# EAGLE design photodiodes-board (EAGLE 7.6.0)
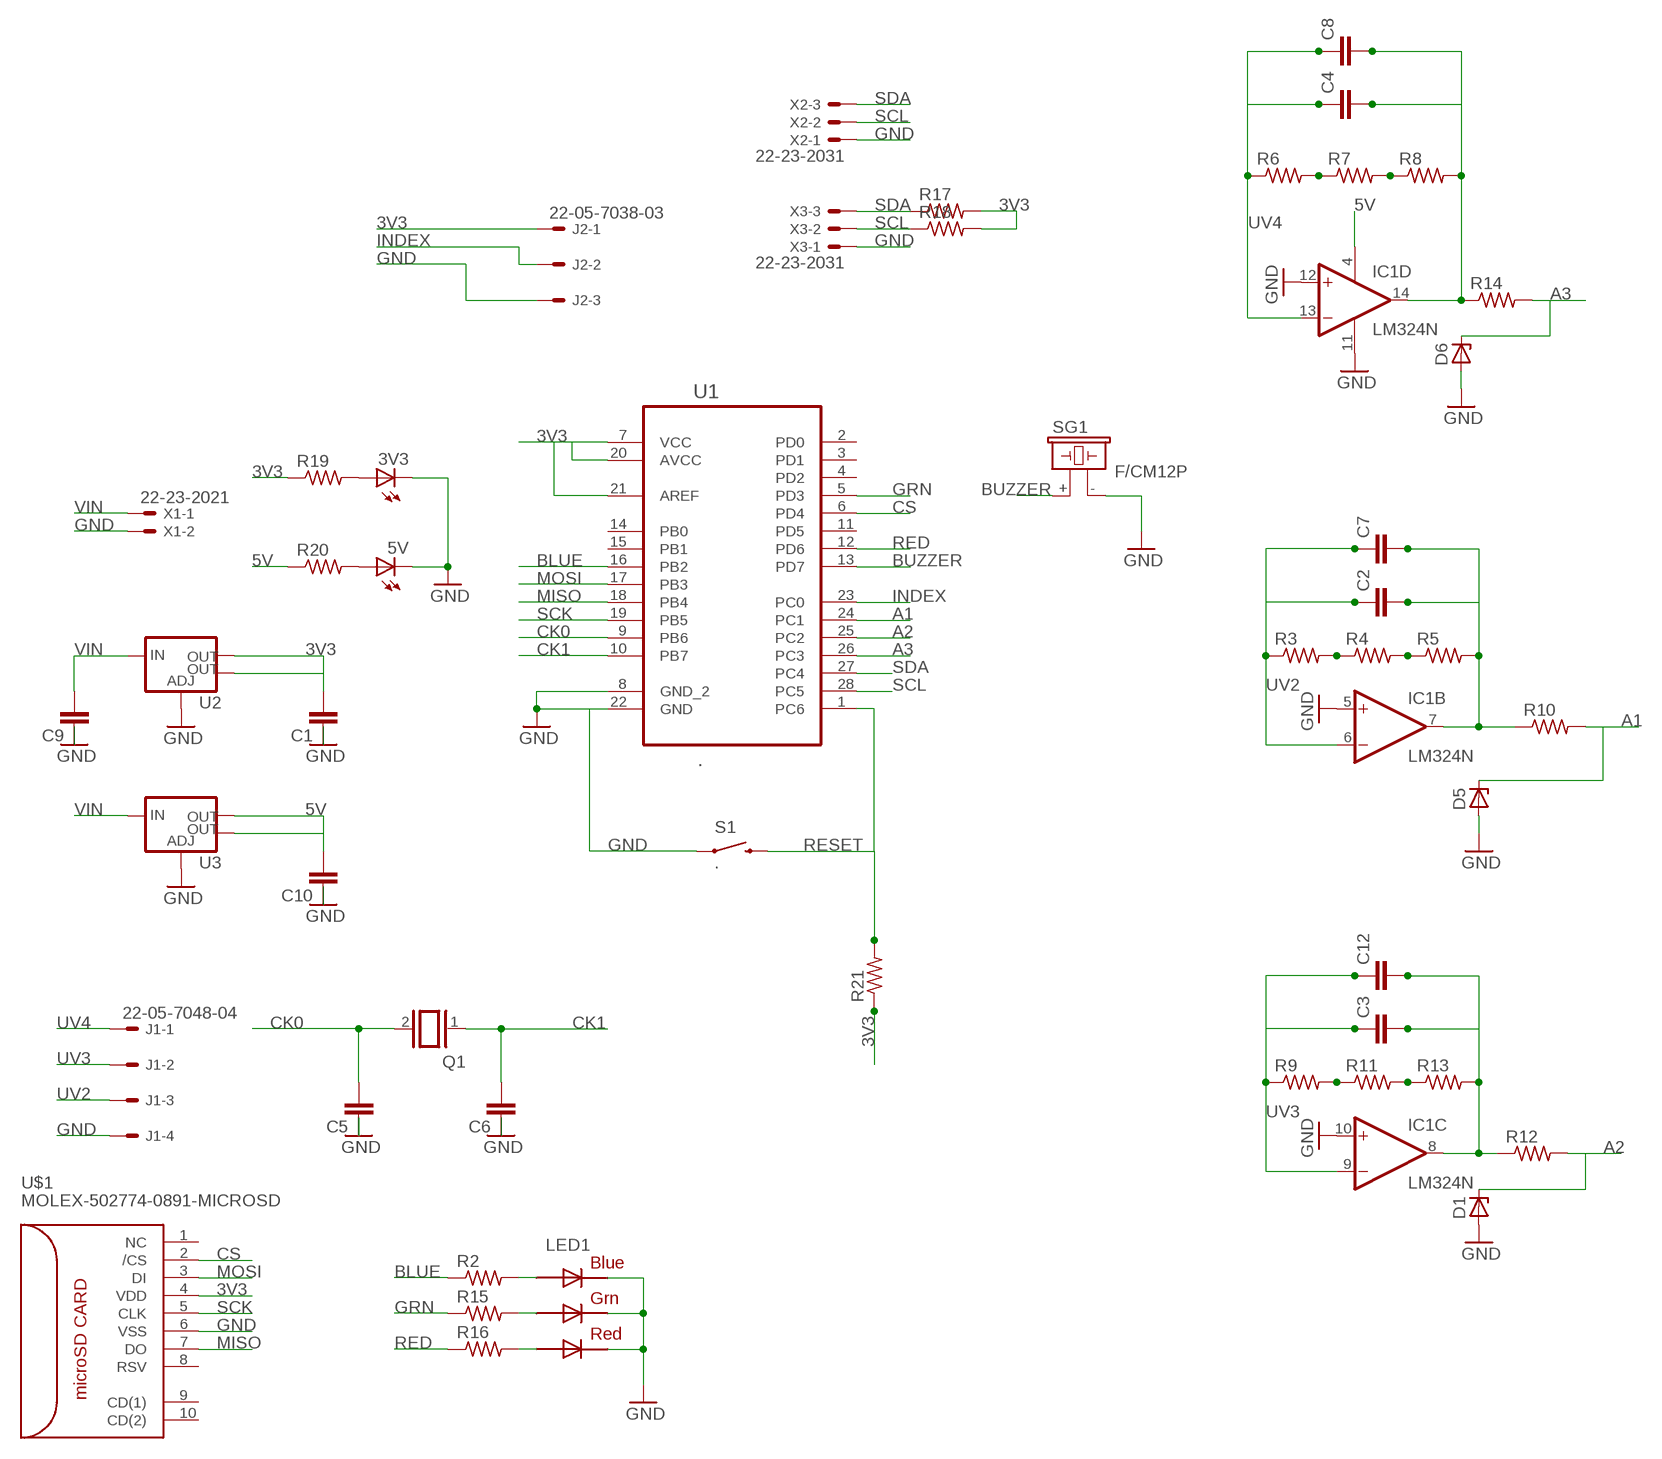
[diagram p0: schematic, sheet 1]

## Parts
3V3  LEDSMT1206  [1206]
5V  LEDSMT1206  [1206]
C1  10UF-1210-50V-20%  [1210]
C2  10UF-1210-50V-20%  [1210]
C3  10UF-1210-50V-20%  [1210]
C4  10UF-1210-50V-20%  [1210]
C5  10UF-1210-50V-20%  [1210]
C6  10UF-1210-50V-20%  [1210]
C7  10UF-1210-50V-20%  [1210]
C8  10UF-1210-50V-20%  [1210]
C9  10UF-1210-50V-20%  [1210]
C10  10UF-1210-50V-20%  [1210]
C12  10UF-1210-50V-20%  [1210]
D1  ZENER-DIODEZD-12.5  [ZDIO12.5]
D5  ZENER-DIODEZD-12.5  [ZDIO12.5]
D6  ZENER-DIODEZD-12.5  [ZDIO12.5]
IC1  LM324N  [DIL14]
J1  22-05-7048-04  [7395-04]
J2  22-05-7038-03  [7395-03]
LED1  .  RGBLED5050  [RGBLED5050]
Q1  XTAL/S  [QS]
R2  R-US_M1206  [M1206]
R3  R-US_0207/12  [0207/12]
R4  R-US_0207/12  [0207/12]
R5  R-US_0207/12  [0207/12]
R6  R-US_0207/12  [0207/12]
R7  R-US_0207/12  [0207/12]
R8  R-US_0207/12  [0207/12]
R9  R-US_0207/12  [0207/12]
R10  R-US_M1206  [M1206]
R11  R-US_0207/12  [0207/12]
R12  R-US_M1206  [M1206]
R13  R-US_0207/12  [0207/12]
R14  R-US_M1206  [M1206]
R15  R-US_M1206  [M1206]
R16  R-US_M1206  [M1206]
R17  R-US_M1206  [M1206]
R18  R-US_M1206  [M1206]
R19  R-US_M1206  [M1206]
R20  R-US_M1206  [M1206]
R21  R-US_M1206  [M1206]
S1  .  SWITCH-MOMENTARY-2SMD-1101NE  [TACTILE-SWITCH-1101NE]
SG1  F/CM12P  [F/CM12P]
U1  .  ATMEGA328P-PU  [DIP254P762X457-28]
U2  V_REG_LM1117SOT223  [SOT223]
U3  V_REG_LM1117SOT223  [SOT223]
U$1  MOLEX-502774-0891-MICROSD  [MOLEX-502774-0891-MICROSD]
X1  22-23-2021  [22-23-2021]
X2  22-23-2031  [22-23-2031]
X3  22-23-2031  [22-23-2031]

## Nets
3V3: C1.2 J2.1 R17.2 R18.2 R19.1 R21.1 U1.7(VCC) U1.20(AVCC) U1.21(AREF) U2.2(OUT) U2.4(OUT) U$1.4(VDD)
5V: C10.2 IC1.4(P:V+) R20.1 U3.2(OUT) U3.4(OUT)
A1: D5.C R10.2 U1.24(PC1)
A2: D1.C R12.2 U1.25(PC2)
A3: D6.C R14.2 U1.26(PC3)
BLUE: R2.1 U1.16(PB2)
BUZZER: SG1.+ U1.13(PD7)
CK0: C5.2 Q1.2 U1.9(PB6)
CK1: C6.2 Q1.1 U1.10(PB7)
CS: U1.6(PD4) U$1.2(/CS)
GND: 3V3.C 5V.C C1.1 C5.1 C6.1 C9.1 C10.1 D1.A D5.A D6.A IC1.5(B:+IN) IC1.10(C:+IN) IC1.11(P:V-) IC1.12(D:+IN) J1.4 J2.3 LED1.4(BLUE_C) LED1.5(RED_C) LED1.6(GREEN_C) S1.1 SG1.- U1.8(GND_2) U1.22(GND) U2.1(ADJ) U3.1(ADJ) U$1.6(VSS) X1.2 X2.1 X3.1
GRN: R15.1 U1.5(PD3)
INDEX: J2.2 U1.23(PC0)
MISO: U1.18(PB4) U$1.7(DO)
MOSI: U1.17(PB3) U$1.3(DI)
N$1: R3.2 R4.1
N$2: R4.2 R5.1
N$3: R6.2 R7.1
N$4: R7.2 R8.1
N$5: R9.2 R11.1
N$6: R11.2 R13.1
N$7: LED1.3(BLUE_A) R2.2
N$8: LED1.1(GREEN_A) R15.2
N$9: LED1.2(RED_A) R16.2
N$11: 3V3.A R19.2
N$12: 5V.A R20.2
N$15: C4.2 C8.2 IC1.14(D:OUT) R8.2 R14.1
N$20: C3.2 C12.2 IC1.8(C:OUT) R12.1 R13.2
N$28: C2.2 C7.2 IC1.7(B:OUT) R5.2 R10.1
RED: R16.1 U1.12(PD6)
RESET: R21.2 S1.2 U1.1(PC6)
SCK: U1.19(PB5) U$1.5(CLK)
SCL: R18.1 U1.28(PC5) X2.2 X3.2
SDA: R17.1 U1.27(PC4) X2.3 X3.3
UV2: C2.1 C7.1 IC1.6(B:-IN) J1.3 R3.1
UV3: C3.1 C12.1 IC1.9(C:-IN) J1.2 R9.1
UV4: C4.1 C8.1 IC1.13(D:-IN) J1.1 R6.1
VIN: C9.2 U2.3(IN) U3.3(IN) X1.1
Unconnected: IC1.1(A:OUT) IC1.2(A:-IN) IC1.3(A:+IN) U1.2(PD0) U1.3(PD1) U1.4(PD2) U1.11(PD5) U1.14(PB0) U1.15(PB1) U$1.1(NC) U$1.8(RSV) U$1.9(CD(1)) U$1.10(CD(2))

## Library data of the parts
3V3 5V = adafruit:LED: LED OSRAM: - CHIPLED LG R971, LG N971, LY N971, LG Q971, LY Q971, LO R971, LY R971 LH N974, LH R974 LS Q976, LO Q976, LY Q976 LO Q996 - Hyper CHIPLED LW Q18S LB Q993, LB Q99A, LB R99A - SideLED LS A670, LO A670, LY A670, LG A670, LP A670 LB A673, LV A673, LT A673, LW A673 LH A674 LY A675 LS A676, LA A676, LO A676, LY A676, LW A676 LS A679, LY A679, LG A679 - Hyper Micro SIDELED® LS Y876, LA Y876, LO Y876, LY Y876 LT Y87S - SmartLED LW L88C, LW L88S LB L89C, LB L89S, LG L890 LS L89K, LO L89K, LY L89K LS L896, LA L896, LO L896, LY L896 - TOPLED LS T670, LO T670, LY T670, LG T670, LP T670 LSG T670, LSP T670, LSY T670, LOP T670, LYG T670 LG T671, LOG T671, LSG T671 LB T673, LV T673, LT T673, LW T673 LH T674 LS T676, LA T676, LO T676, LY T676, LB T676, LH T676, LSB T676, LW T676 LB T67C, LV T67C, LT T67C, LS T67K, LO T67K, LY T67K, LW E67C LS E67B, LA E67B, LO E67B, LY E67B, LB E67C, LV E67C, LT E67C LW T67C LS T679, LY T679, LG T679 LS T770, LO T770, LY T770, LG T770, LP T770 LB T773, LV T773, LT T773, LW T773 LH T774 LS E675, LA E675, LY E675, LS T675 LS T776, LA T776, LO T776, LY T776, LB T776 LHGB T686 LT T68C, LB T68C - Hyper Mini TOPLED® LB M676 - Mini TOPLED Santana® LG M470 LS M47K, LO M47K, LY M47K Source: http://www.osram.convergy.de/
C1-C10 C12 = SparkFun-Capacitors:10UF: 10.0µF ceramic capacitors A capacitor is a passive two-terminal electrical component used to store electrical energy temporarily in an electric field.; PROD_ID: CAP-09824; VALUE: 10uF
D1 D5 D6 = diode:ZENER-DIODE: Z-Diode
IC1 = linear:LM324: OP AMP
J1 = con-molex:22-?-04: CONNECTOR wire to board 2.54 mm (.1 inch) pitch header; OC_FARNELL: unknown; OC_NEWARK: unknown
J2 = con-molex:22-?-03: CONNECTOR wire to board 2.54 mm (.1 inch) pitch header; OC_FARNELL: unknown; OC_NEWARK: unknown
LED1 = adafruit:RGBLED: For 5050 RGB LEDs, the order of the LEDs may vary from one manufacturer to another!
Q1 = special:XTAL/S: CRYSTAL
R2-R21 = adafruit:R-US_: RESISTOR, American symbol
S1 = SparkFun-Electromechanical:SWITCH-MOMENTARY-2: Various NO switches- pushbuttons, reed, etc; PROD_ID: SWCH-00815
SG1 = buzzer:F/CM12P: BUZZER Source: Buerklin; OC_FARNELL: unknown; OC_NEWARK: unknown
U1 = Atmel_By_element14_Batch_1-00:ATMEGA328P-PU: 8-bit Microcontroller with In-System Programmable Flash; MPN: ATMEGA328P-PU; OC_FARNELL: 1715487; OC_NEWARK: 15R0268; PACKAGE: PDIP-28; SUPPLIER: Atmel
U2 U3 = SparkFun-IC-Power:V_REG_LM1117: Voltage Regulator LM1117 Standard adjustable voltage regulator but in SMD form. Spark Fun Electronics SKU : COM-00595; PROD_ID: VREG-08170
U$1 = Ava:MOLEX-502774-0891-MICROSD; FARNELL: 2064063
X1 = con-molex:22-23-2021: .100" (2.54mm) Center Header - 2 Pin; MF: MOLEX; MPN: 22-23-2021; OC_FARNELL: 1462926; OC_NEWARK: 25C3832
X2 X3 = con-molex:22-23-2031: .100" (2.54mm) Center Header - 3 Pin; MF: MOLEX; MPN: 22-23-2031; OC_FARNELL: 1462950; OC_NEWARK: 30C0862

## Net classes
0 default: width 0.406 mm

## Board
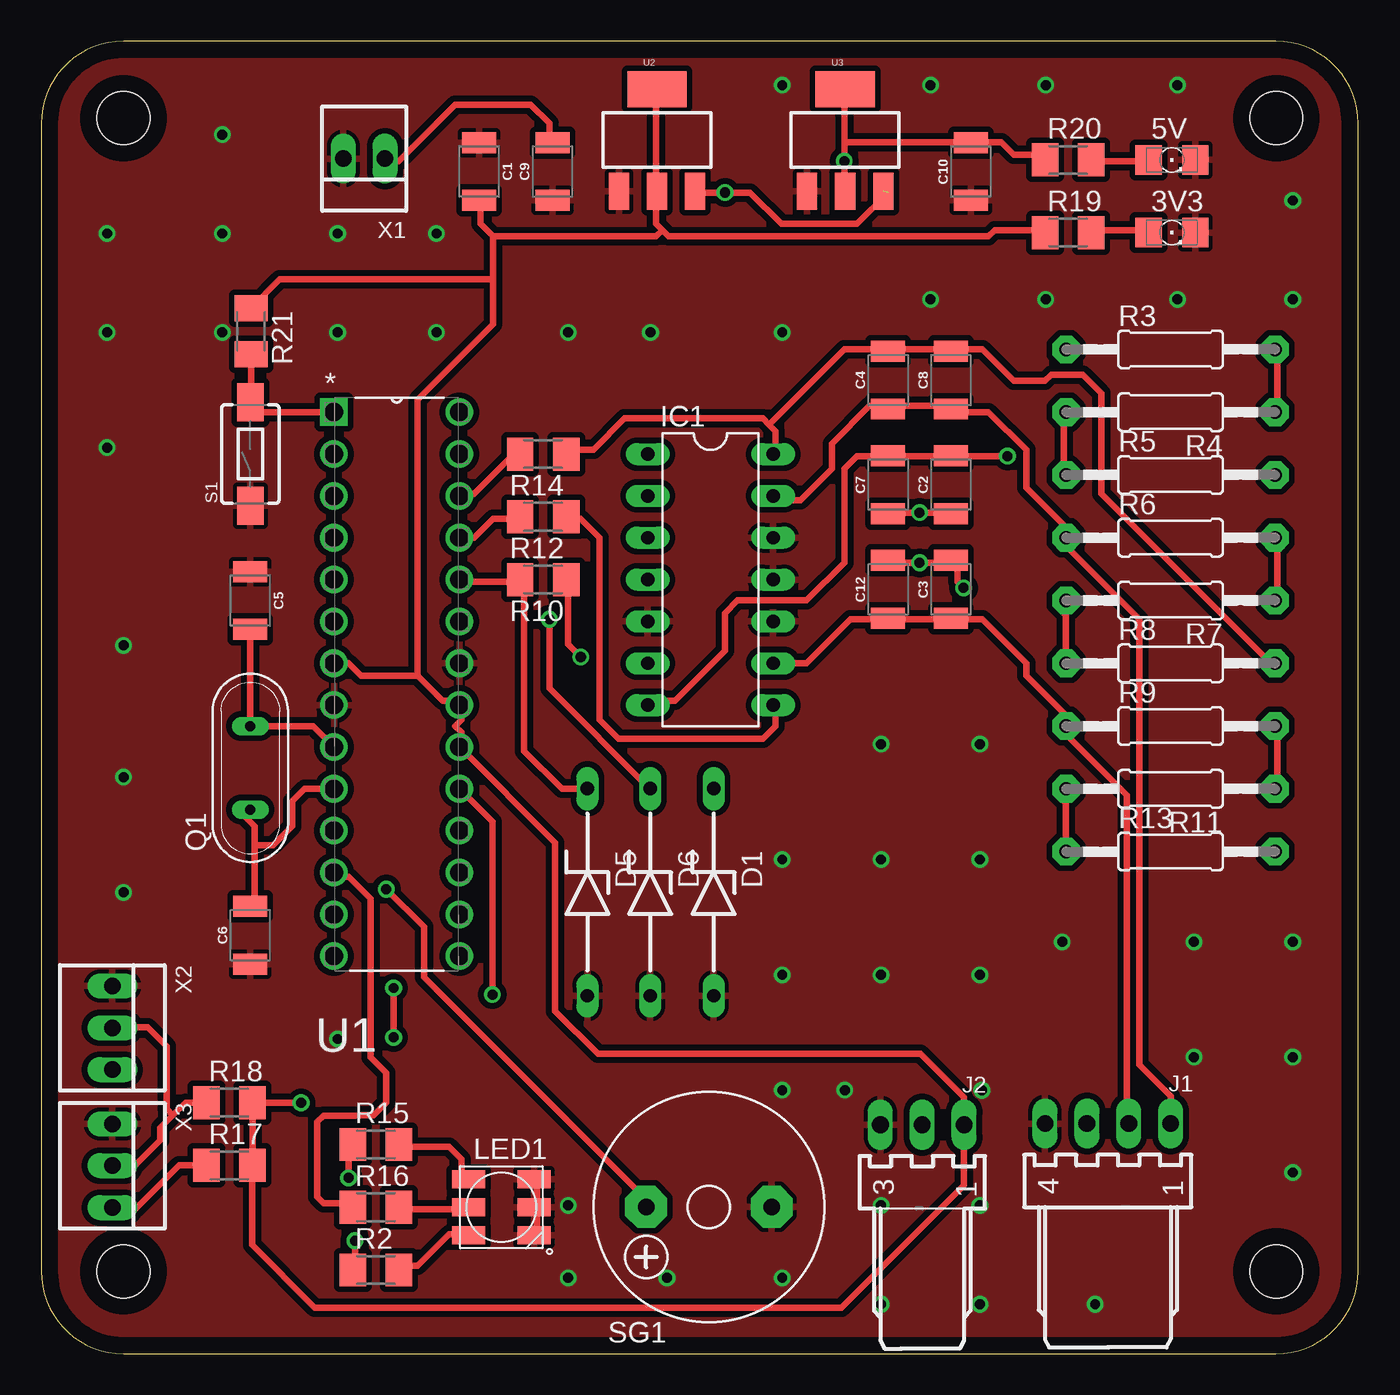
[diagram p1: board, top side]
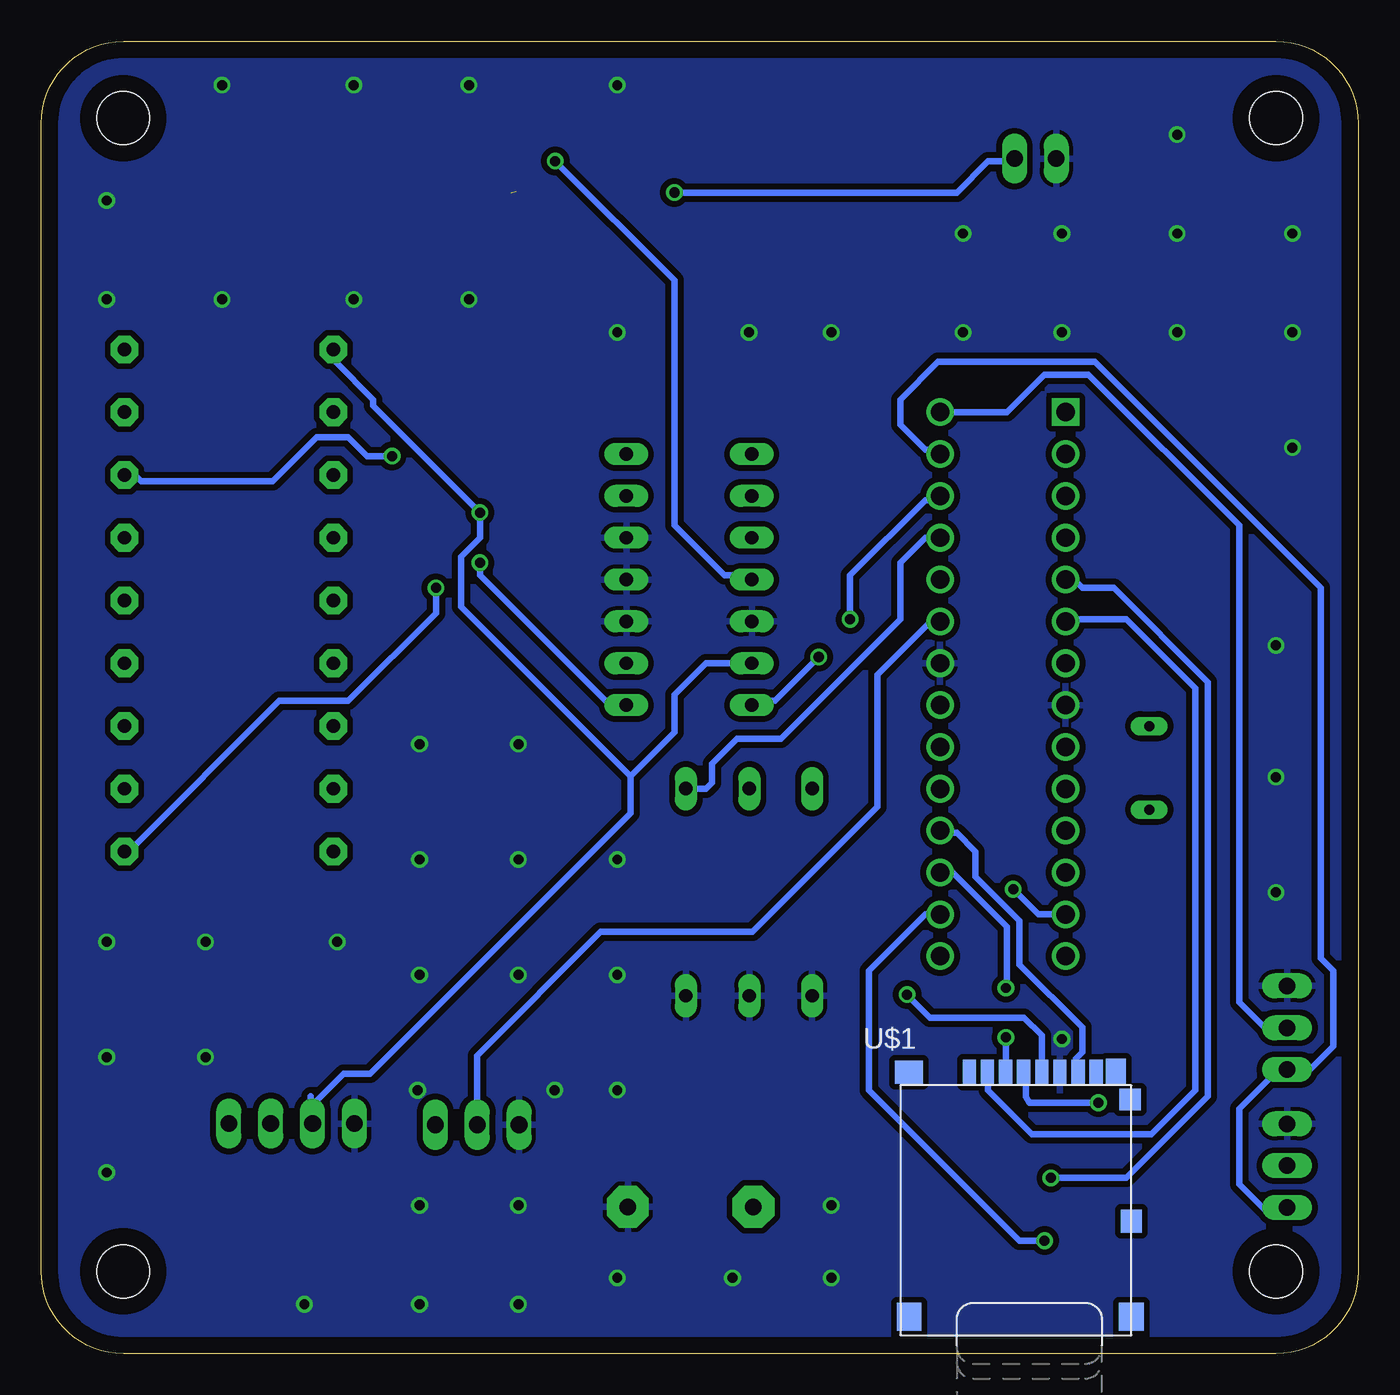
[diagram p2: board, bottom side, seen from below]

Size 79.98 x 79.67 mm. Coordinates in mm from the lower left corner, seen from the top.
Outline: 74.98,79.67 5,79.67 arc90 0,74.67 0,5 arc90 5,0 74.98,0 arc90 79.98,5 79.98,74.67 arc90 74.98,79.67
Copper layers (1*16): Top 0.035mm / dielectric 1.5mm / Bottom 0.035mm
Design rules "default *": minimum track width 16mil, minimum drill 24mil, track to track 14mil, track to pad 14mil, pad to pad 8mil, via to via 8mil, smd to smd 8mil, copper to edge 40mil, drill to drill 8mil, minimum pad ring 10mil, minimum via ring 8mil, stop-mask expansion 4mil, vias tented up to drill 100mil, thermal gap 10mil
Holes 3.2 mm at 5,5 75,75 5,75 75,5

### Footprints (pad centres in the part's own frame; a part is rotated, then mirrored left to right if it is on the bottom)
1206 = smd 1.6 x 1.803: A -1.422,0; C 1.422,0
1210 = smd 1.27 x 2.06: 1 -1.755,0; 2 1.755,0
ZDIO12.5 = drill 0.813 long: A 6.223,0; C -6.35,0
DIL14 = drill 0.813 long: 1 -7.62,-3.81; 2 -5.08,-3.81; 3 -2.54,-3.81; 4 0,-3.81; 5 2.54,-3.81; 6 5.08,-3.81; 7 7.62,-3.81; 8 7.62,3.81; 9 5.08,3.81; 10 2.54,3.81; 11 0,3.81; 12 -2.54,3.81; 13 -5.08,3.81; 14 -7.62,3.81
7395-04 = drill 1.016 long: 1 3.81,0; 2 1.27,0; 3 -1.27,0; 4 -3.81,0
7395-03 = drill 1.016 long: 1 2.54,0; 2 0,0; 3 -2.54,0
RGBLED5050 = smd 2 x 1.1: 1 -2,1.7; 2 -2,0; 3 -2,-1.7; 4 2,-1.7; 5 2,0; 6 2,1.7
QS = drill 0.61 long: 1 -2.54,0; 2 2.54,0
M1206 = smd 1.6 x 2: 1 -1.4,0; 2 1.4,0
0207/12 = drill 0.813 pad 1.676 octagon: 1 -6.35,0; 2 6.35,0
TACTILE-SWITCH-1101NE = smd 2.3 x 1.6: 1 -3.15,0; 2 3.15,0
F/CM12P = drill 1.016 pad 2.54 octagon: + 3.81,0; - -3.81,0
DIP254P762X457-28 = drill 1.118 square: 1 -7.62,33.02 | drill 1.118: 2 -7.62,30.48; 3 -7.62,27.94; 4 -7.62,25.4; 5 -7.62,22.86; 6 -7.62,20.32; 7 -7.62,17.78; 8 -7.62,15.24; 9 -7.62,12.7; 10 -7.62,10.16; 11 -7.62,7.62; 12 -7.62,5.08; 13 -7.62,2.54; 14 -7.62,0; 15 0,0; 16 0,2.54; 17 0,5.08; 18 0,7.62; 19 0,10.16; 20 0,12.7; 21 0,15.24; 22 0,17.78; 23 0,20.32; 24 0,22.86; 25 0,25.4; 26 0,27.94; 27 0,30.48; 28 0,33.02
SOT223 = smd 1.219 x 2.235: 1 -2.311,-3.099; 2 0,-3.099; 3 2.311,-3.099 | smd 3.6 x 2.2: 4 0,3.099
MOLEX-502774-0891-MICROSD = smd 0.8 x 1.5: 1 -3.3,8.2; 2 -2.2,8.2; 3 -1.1,8.2; 4 0,8.2; 5 1.1,8.2; 6 2.2,8.2; 7 3.3,8.2; 8 4.4,8.2 | smd 1.29 x 1.3: 9 6.455,6.55 | smd 1.29 x 1.4: 10 6.54,-0.85 | smd 1.5 x 1.7: 11 6.54,-6.65; 12 -6.96,-6.65 | smd 1.7 x 1.4: 14 -6.96,8.2 | smd 1.2 x 1.6: 15 5.6,8.2
22-23-2021 = drill 1 long: 1 -1.27,0; 2 1.27,0
22-23-2031 = drill 1 long: 1 -2.54,0; 2 0,0; 3 2.54,0

### Placement (x,y rotation side)
3V3  68.66,68.05 0 top
5V  68.66,72.46 0 top
C1  26.59,71.76 270 top
C2  55.24,52.75 90 top
C3  55.24,46.4 90 top
C4  51.43,59.1 90 top
C5  12.7,45.72 270 top
C6  12.7,25.4 90 top
C7  51.43,52.75 90 top
C8  55.24,59.1 90 top
C9  31.04,71.76 90 top
C10  56.45,71.76 90 top
C12  51.43,46.4 90 top
D1  40.83,27.95 270 top
D5  33.17,27.95 270 top
D6  36.98,27.95 270 top
IC1  40.64,46.99 270 top
J1  64.77,13.97 0 top
J2  53.5,13.9 0 top
LED1  27.94,8.89 0 top
Q1  12.7,35.56 90 top
R2  20.32,5.08 0 top
R3  68.58,60.96 0 top
R4  68.58,57.15 180 top
R5  68.58,53.34 0 top
R6  68.58,49.53 0 top
R7  68.58,45.72 180 top
R8  68.58,41.91 0 top
R9  68.58,38.1 0 top
R10  30.48,46.99 180 top
R11  68.58,34.29 180 top
R12  30.48,50.8 180 top
R13  68.58,30.48 0 top
R14  30.48,54.61 180 top
R15  20.32,12.7 0 top
R16  20.32,8.89 0 top
R17  11.43,11.43 0 top
R18  11.43,15.24 0 top
R19  62.36,68.05 0 top
R20  62.36,72.46 0 top
R21  12.74,62.06 270 top
S1  12.7,54.61 90 top
SG1  40.55,8.91 180 top
U1  25.4,24.13 0 top
U2  37.39,73.66 0 top
U3  48.82,73.66 0 top
U$1  20.32,8.89 0 bottom
X1  19.61,72.54 180 top
X2  4.32,19.78 270 top
X3  4.32,11.41 270 top

### Tracks (layer width: path | path; a pad name or v marks a point on that pad's centre or on a via)
3V3  (via drill 0.6)
  Top 0.406: 37.72,68.2 37.34,68.58 37.34,70.48 U2.2 37.34,70.87 37.34,76.58 U2.4 | 37.72,68.2 38.1,67.82 57.53,67.82 57.91,68.2 60.96,68.2 R19.1 | 27.43,67.82 26.67,68.58 26.67,69.72 C1.2 | 27.43,67.82 37.34,67.82 37.72,68.2 | 22.86,41.15 24.38,39.62 25.15,39.62 U1.21 25.53,39.24 25.53,38.48 25.15,38.1 25.53,37.72 25.53,36.96 U1.20 31.2,31.03 31.2,20.8 33.8,18.2 53.4,18.2 56.04,15.56 J2.1 56.04,10.24 48.6,2.8 16.6,2.8 12.8,6.6 12.8,11.4 R17.2 R18.2 15.64,15.24 v15.79,15.23 | 22.86,41.15 19.43,41.15 18.67,41.91 U1.7 | 27.43,65.22 27.43,62.48 22.86,57.91 22.86,41.15 | 27.43,65.22 27.43,67.82 | R21.1 14.49,65.22 27.43,65.22
  Bottom 0.406: U$1.4 20.2,16.97 20.2,15.6 19.98,15.23 v15.79,15.23
5V  (via drill 0.61)
  Top 0.406: R20.1 60.96,72.77 59.05,72.77 58.29,73.53 56.77,73.53 C10.2 56.39,73.53 48.77,73.53 | 48.77,73.53 48.77,76.58 U3.4 | 48.77,73.53 v48.77,72.39 48.77,70.87 U3.2
  Bottom 0.406: v48.77,72.39 41.53,65.15 41.53,50.29 38.48,47.24 36.96,47.24 IC1.4
A1
  Top 0.406: U1.24 25.53,46.86 28.96,46.86 R10.2 29.34,46.86 29.34,36.58 31.62,34.29 33.15,34.29 D5.C
A2
  Top 0.406: U1.25 26.29,49.53 27.43,50.67 28.96,50.67 R12.2
  Bottom 0.406: U1.25 26.29,49.53 27.81,48.01 27.81,44.58 35.05,37.34 37.72,37.34 39.24,35.81 39.24,34.67 39.62,34.29 41.15,34.29 D1.C
A3  (via drill 0.61)
  Top 0.406: R14.2 28.96,54.48 28.57,54.48 26.29,52.2 25.53,52.2 U1.26 | v30.86,44.58 30.86,40.39 36.95,34.3 D6.C
  Bottom 0.406: v30.86,44.58 30.86,47.24 26.29,51.82 25.53,51.82 U1.26
BLUE  (via drill 0.61)
  Top 0.406: v19.05,6.86 19.05,5.33 R2.1
  Bottom 0.406: v19.05,6.86 20.57,6.86 29.72,16 29.72,23.24 26.29,26.67 U1.16
BUZZER  (via drill 0.61)
  Top 0.406: v20.95,28.19 23.24,25.91 23.24,22.86 36.74,9.36 SG1.+
  Bottom 0.406: U1.13 19.43,26.67 v20.95,28.19
CK0
  Top 0.406: C5.2 12.95,43.81 12.7,43.81 Q1.2 16.51,38.1 U1.9
CK1
  Top 0.406: 12.95,30.86 12.95,32 12.19,32.77 12.57,33.15 Q1.1 | 12.95,30.86 12.95,27.43 C6.2 | U1.10 16,34.29 15.24,33.53 15.24,32 14.1,30.86 12.95,30.86
CS
  Bottom 0.406: U$1.2 22.48,16.76 22.48,16 19.81,13.34 12.57,13.34 9.91,16 9.91,40.39 14.1,44.58 17.53,44.58 U1.6
GND  (via drill 0.6)
  Top 0.406: LED1.4 30.1,7.24 30.1,8.76 LED1.5 30.1,9.14 30.1,10.29 LED1.6
  other vias: 18,19.1 11,74 11,68 4,68 4,62 11,62 18,68 24,68 18,62 24,62 4,55 5,43 5,35 5,28 32,4.6 38,4.6 32,9 45,4.6 51,3 57,3 57,9 51,9 45,16 48.8,16 57.12,15.99 64,3 76,11 76,18 70,18 70,25 76,25 62,25 57,23 51,23 45,23 45,30 51,30 57,30 57,37 51,37 76,64 76,70 69,64 61,64 54,64 45,62 37,62 32,62 45,77 54,77 61,77 69,77
  pour Bottom: 80,75 80,5 arc-90 75,0 5,0 arc-90 0,5 0,75 arc-90 5,80 75,80 arc-90
  pour Top: 0,75 0,5 arc90 5,0 75,0 arc90 80,5 80,75 arc90 75,80 5,80 arc90
GRN  (via drill 0.61)
  Top 0.406: v18.67,10.67 18.67,12.57 R15.1
  Bottom 0.406: v18.67,10.67 14.1,10.67 9.14,15.62 9.14,40.77 14.86,46.48 16.76,46.48 17.53,47.24 U1.5
INDEX
  Bottom 0.406: J2.2 53.5,18.1 46,25.6 36.8,25.6 29.2,33.2 29.2,41.2 25.95,44.45 U1.23
MISO
  Bottom 0.406: U$1.7 17.14,17.14 17.14,17.91 16.76,18.29 16.76,19.81 20.57,23.62 20.57,26.29 23.24,28.96 23.24,30.48 24.38,31.62 25.15,31.62 U1.18
MOSI  (via drill 0.6)
  Top 0.406: v21.4,22.2 v21.4,19.2
  Bottom 0.406: 21.34,17.14 U$1.3 21.4,17.11 v21.4,19.2 | U1.17 25.53,29.34 25.15,29.72 21.34,25.91 21.34,22.26 v21.4,22.2
N$1
  Top 0.406: 75.06,57.91 75.06,57.15 R4.1 75.06,57.28 75.06,60.96 R3.2
N$2
  Top 0.406: R5.1 62.1,53.34 62.1,57.15 R4.2
N$3
  Top 0.406: 75.06,46.48 75.06,45.72 R7.1 75.06,45.85 75.06,49.53 R6.2
N$4
  Top 0.406: 62.1,44.96 62.1,45.72 R7.2 R8.1
N$5
  Top 0.406: 75.06,35.05 75.06,34.29 R11.1 75.06,34.42 75.06,38.1 R9.2
N$6
  Top 0.406: R11.2 62.1,34.29 62.1,33.53 62.23,33.4 R13.1
N$7
  Top 0.406: R2.2 22.1,5.33 22.86,5.33 24.77,7.24 25.91,7.24 LED1.3
N$8
  Top 0.406: R15.2 22.1,12.57 24.77,12.57 25.53,11.81 25.53,10.67 25.91,10.29 LED1.1
N$9
  Top 0.406: R16.2 22.1,8.76 25.91,8.76 LED1.2
N$11
  Top 0.406: 3V3.A 67.06,68.2 64.01,68.2 R19.2
N$12
  Top 0.406: 5V.A 67.06,72.39 64.01,72.39 R20.2
N$15
  Top 0.406: 44.2,56.39 44.58,56.01 44.58,54.86 IC1.14 | 44.2,56.39 43.81,56.77 35.43,56.77 33.53,54.86 32,54.86 R14.1 | 44.2,56.39 48.77,60.96 51.05,60.96 C4.2 51.44,60.96 54.86,60.96 C8.2 55.24,60.96 57.15,60.96 59.05,59.05 60.96,59.05 61.34,59.44 63.25,59.44 64.39,58.29 64.39,52.2 74.68,41.91 R8.2
N$20  (via drill 0.61)
  Top 0.406: C12.2 51.44,48.01 v53.34,48.01 54.86,48.01 C3.2 55.24,48.39 55.63,48.01 55.63,46.86 v56.01,46.48 | R12.1 32,50.67 32.77,50.67 33.91,49.53 33.91,38.48 35.05,37.34 43.81,37.34 44.58,38.1 44.58,39.24 IC1.8
  Bottom 0.406: v53.34,48.01 53.34,47.24 45.72,39.62 44.58,39.62 IC1.8 | v56.01,46.48 56.01,44.96 61.34,39.62 65.53,39.62 74.68,30.48 R13.2
N$28  (via drill 0.61)
  Top 0.406: v32.77,42.29 32,43.05 32,46.86 R10.1 | v58.67,54.48 55.24,54.48 C2.2 54.86,54.48 51.44,54.48 C7.2 51.05,54.48 49.53,54.48 48.77,53.72 48.77,48.01 46.48,45.72 42.29,45.72 41.53,44.96 41.53,42.67 38.48,39.62 36.96,39.62 IC1.7
  Bottom 0.406: v32.77,42.29 35.43,39.62 36.58,39.62 IC1.7 | v58.67,54.48 60.2,54.48 61.34,55.63 63.25,55.63 65.91,52.96 73.91,52.96 74.3,53.34 R5.2
RED
  Top 0.406: R16.1 18.67,9.14 17.14,9.14 16.76,9.53 16.76,14.08 17.14,14.46 19.05,14.46 19.43,14.48 20.19,14.48 20.95,15.24 20.95,17.05 20,18 20,27.62 18.67,28.96 17.91,28.96 U1.12
RESET
  Top 0.406: U1.1 12.95,57.15 12.57,57.53 S1.2 12.57,57.91 12.19,58.29 12.74,58.84 R21.2
SCK  (via drill 0.6)
  Top 0.406: v27.4,21.8 27.4,32.29 U1.19
  Bottom 0.406: U$1.5 19.22,19.32 20.3,20.4 26,20.4 v27.4,21.8
SCL
  Top 0.406: R18.1 8.76,15.24 8,14.48 | 8,14.48 7.24,13.72 7.24,12.95 5.71,11.43 4.57,11.43 X3.2 | 8,14.48 7.62,14.86 7.62,18.67 6.48,19.81 4.57,19.81 X2.2
  Bottom 0.406: U1.28 21.34,57.15 19.05,59.44 16.38,59.44 7.24,50.29 7.24,21.34 5.71,19.81 4.57,19.81 X2.2
SDA
  Top 0.406: R17.1 8.38,11.43 5.71,8.76 4.57,8.76 X3.3
  Bottom 0.406: X3.3 4.57,8.76 5.71,8.76 7.24,10.29 7.24,14.86 4.95,17.14 4.57,17.14 X2.3 4.19,17.14 3.05,17.14 1.52,18.67 1.52,23.24 2.29,24 2.29,46.48 16,60.2 25.53,60.2 27.81,57.91 27.81,56.39 26.29,54.86 25.53,54.86 U1.27
UV2  (via drill 0.61)
  Top 0.406: C7.1 51.44,51.05 v53.34,51.05 54.86,51.05 C2.1
  Bottom 0.406: R3.1 62.1,60.96 62.1,60.2 59.82,57.91 59.82,57.53 v53.34,51.05 53.34,49.53 54.48,48.39 54.48,45.34 44.2,35.05 | IC1.6 39.62,41.91 41.53,40.01 41.53,37.72 44.2,35.05 | 63.63,15 63.63,14.1 J1.3 | 63.63,15 63.63,15.62 | 44.2,35.05 44.2,32.8 60,17 61.63,17 63.63,15
UV3
  Top 0.406: IC1.9 46.48,41.91 49.15,44.58 51.05,44.58 C12.1 51.44,44.58 54.86,44.58 C3.1 55.24,44.58 57.15,44.58 59.82,41.91 59.82,41.15 62.1,38.86 62.1,38.1 R9.1 62.48,38.1 62.48,37.34 65.91,33.91 65.91,14.1 J1.2
UV4
  Top 0.406: IC1.13 44.58,51.82 46.1,51.82 48.01,53.72 48.01,55.24 50.29,57.53 51.05,57.53 C4.1 51.44,57.53 54.86,57.53 C8.1 55.24,57.15 57.53,57.15 59.82,54.86 59.82,52.58 62.1,50.29 62.1,49.53 R6.1 62.48,49.53 62.48,48.77 66.67,44.58 66.67,17.53 68.58,15.62 J1.1
VIN  (via drill 0.61)  (1 unrouted)
  Top 0.406: 51.44,70.48 49.53,68.58 44.96,68.58 43.05,70.48 v41.53,70.48 40.01,70.48 U2.3 | C9.2 30.86,73.53 30.86,74.68 29.72,75.82 25.15,75.82 21.72,72.39 21.4,72.39 21.25,72.54 X1.1 20.95,72.77
  Bottom 0.406: v41.53,70.48 24.38,70.48 22.48,72.39 20.95,72.39 X1.1

### Text on the board
200bmp: AEROSPACE | STRATOPHOTOM v2.0